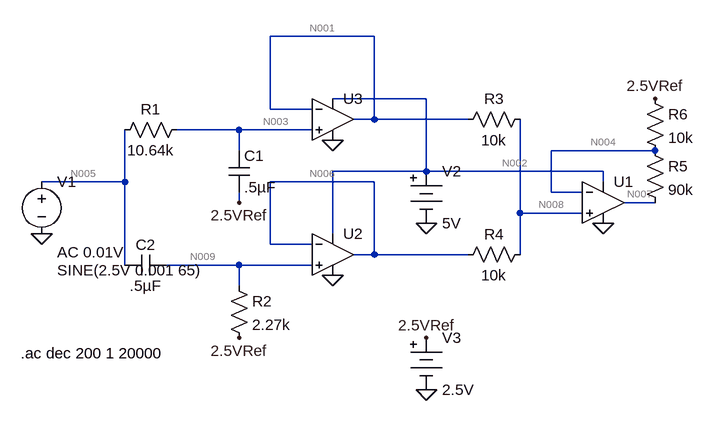
[diagram p0: schematic Band Stop Passive Filter.asc]
Band Stop Passive Filter.asc, the LTspice schematic file:
Version 4
SHEET 1 976 680
WIRE 480 -32 320 -32
WIRE 560 64 416 64
WIRE 320 80 320 -32
WIRE 384 80 320 80
WIRE 480 96 480 -32
WIRE 480 96 448 96
WIRE 624 96 480 96
WIRE 272 112 176 112
WIRE 384 112 272 112
WIRE 272 144 272 112
WIRE 912 144 752 144
WIRE 560 176 560 64
WIRE 560 176 416 176
WIRE 832 176 560 176
WIRE 96 192 96 112
WIRE 96 192 -32 192
WIRE 480 192 320 192
WIRE 832 192 832 176
WIRE 752 208 752 144
WIRE 800 208 752 208
WIRE 272 224 272 208
WIRE 912 224 864 224
WIRE 704 240 704 96
WIRE 800 240 704 240
WIRE 416 272 416 176
WIRE 320 288 320 192
WIRE 384 288 320 288
WIRE 480 304 480 192
WIRE 480 304 448 304
WIRE 624 304 480 304
WIRE 704 304 704 240
WIRE 96 320 96 192
WIRE 272 320 160 320
WIRE 384 320 272 320
WIRE 272 352 272 320
FLAG -32 272 0
FLAG 416 336 0
FLAG 416 128 0
FLAG 832 256 0
FLAG 560 256 0
FLAG 560 512 0
FLAG 560 432 2.5VRef
FLAG 272 432 2.5VRef
FLAG 272 224 2.5VRef
FLAG 912 64 2.5VRef
SYMBOL res 192 96 R90
WINDOW 0 0 56 VBottom 2
WINDOW 3 32 56 VTop 2
SYMATTR InstName R1
SYMATTR Value 10.64k
SYMBOL cap 256 144 R0
SYMATTR InstName C1
SYMATTR Value .5µF
SYMBOL voltage -32 176 R0
WINDOW 3 24 152 Left 2
WINDOW 123 24 124 Left 2
WINDOW 39 0 0 Left 2
SYMATTR Value SINE(2.5V 0.001 65)
SYMATTR Value2 AC 0.01V
SYMATTR InstName V1
SYMBOL cap 160 304 R90
WINDOW 0 0 32 VBottom 2
WINDOW 3 32 32 VTop 2
SYMATTR InstName C2
SYMATTR Value .5µF
SYMBOL res 256 336 R0
SYMATTR InstName R2
SYMATTR Value 2.27k
SYMBOL res 720 80 R90
WINDOW 0 0 56 VBottom 2
WINDOW 3 32 56 VTop 2
SYMATTR InstName R3
SYMATTR Value 10k
SYMBOL res 720 288 R90
WINDOW 0 0 56 VBottom 2
WINDOW 3 32 56 VTop 2
SYMATTR InstName R4
SYMATTR Value 10k
SYMBOL Misc\\battery 560 160 R0
WINDOW 123 0 0 Left 2
WINDOW 39 0 0 Left 2
SYMATTR InstName V2
SYMATTR Value 5V
SYMBOL Misc\\battery 560 416 R0
WINDOW 123 0 0 Left 2
WINDOW 39 0 0 Left 2
SYMATTR InstName V3
SYMATTR Value 2.5V
SYMBOL Opamps\\UniversalOpamp2 832 224 R0
SYMATTR InstName U1
SYMBOL Opamps\\UniversalOpamp2 416 304 R0
SYMATTR InstName U2
SYMBOL Opamps\\UniversalOpamp2 416 96 R0
SYMATTR InstName U3
SYMBOL res 896 128 R0
SYMATTR InstName R5
SYMATTR Value 90k
SYMBOL res 896 48 R0
SYMATTR InstName R6
SYMATTR Value 10k
TEXT -64 456 Left 2 !.ac dec 200 1 20000

The netlist it stands for:
* Band Stop Passive Filter.asc
R1 N003 N005 10.64k
C1 N003 2.5VRef .5µF
V1 N005 0 SINE(2.5V 0.001 65) AC 0.01V
C2 N009 N005 .5µF
R2 N009 2.5VRef 2.27k
R3 N008 N001 10k
R4 N008 N006 10k
V2 N002 0 5V
V3 2.5VRef 0 2.5V
XU1 N008 N004 N002 0 N007 level.2 Avol=1Meg GBW=10Meg Slew=10Meg ilimit=25m rail=0 Vos=0 phimargin=45 en=0 enk=0 in=0 ink=0 Rin=500Meg  ; pins IN+ IN- V+ V- OUT
XU2 N009 N006 N002 0 N006 level.2 Avol=1Meg GBW=10Meg Slew=10Meg ilimit=25m rail=0 Vos=0 phimargin=45 en=0 enk=0 in=0 ink=0 Rin=500Meg  ; pins IN+ IN- V+ V- OUT
XU3 N003 N001 N002 0 N001 level.2 Avol=1Meg GBW=10Meg Slew=10Meg ilimit=25m rail=0 Vos=0 phimargin=45 en=0 enk=0 in=0 ink=0 Rin=500Meg  ; pins IN+ IN- V+ V- OUT
R5 N004 N007 90k
R6 2.5VRef N004 10k
.ac dec 200 1 20000
.lib UniversalOpamps2.sub
.backanno
.end

* Results of the author's LTspice run, read from the files saved beside the schematic
* Operating Point, zero values left out:
*   V(n003) = 2.5 V
*   V(n005) = 2.5 V
*   V(2.5vref) = 2.5 V
*   V(n009) = 2.5 V
*   V(n008) = 2.5 V
*   V(n001) = 2.5 V
*   V(n006) = 2.5 V
*   V(n002) = 5 V
*   V(n007) = 2.5 V
*   V(n004) = 2.5 V
*   I(V2) = -750 µA
*   Ix(u1:3) = 250 µA
*   Ix(u1:4) = -250 µA
*   Ix(u1:5) = 198.4 pA
*   Ix(u2:3) = 250 µA
*   Ix(u2:4) = -250 µA
*   Ix(u2:5) = 198.3 pA
*   Ix(u3:3) = 250 µA
*   Ix(u3:4) = -250 µA
*   Ix(u3:5) = 198.3 pA
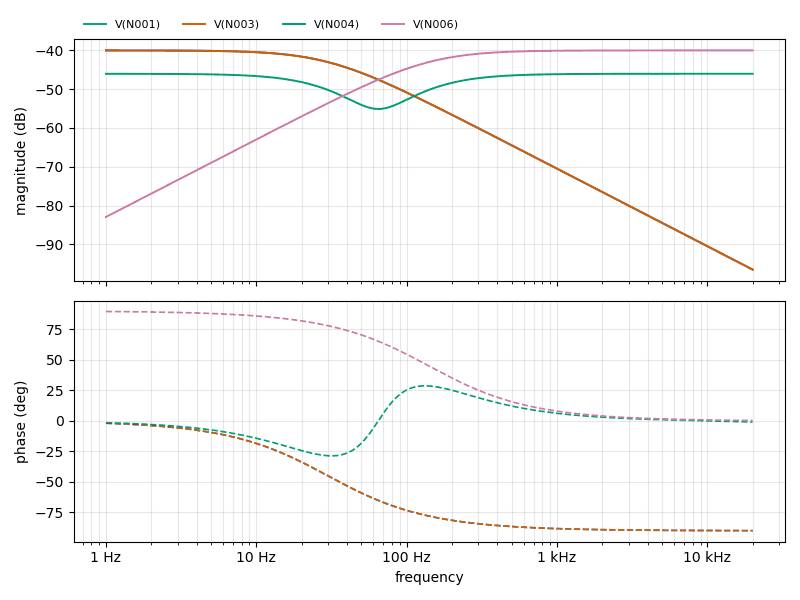
[diagram p1: AC Analysis of Band Stop Passive Filter.asc, plotted from the saved traces]
* AC Analysis, 1 run:
*   V(N001): -40.01 dB at 1 Hz, -96.53 dB at 20 kHz, peak -40.01 dB at 1 Hz, 3 dB below the peak at 29.95 Hz
*   V(N003): -40.01 dB at 1 Hz, -96.50 dB at 20 kHz, peak -40.01 dB at 1 Hz, 3 dB below the peak at 29.95 Hz
*   V(N004): -46.03 dB at 1 Hz, -46.02 dB at 20 kHz, peak -46.02 dB at 12.59 kHz, 3 dB below the peak at 172 Hz
*   V(N006): -82.94 dB at 1 Hz, -40.00 dB at 20 kHz, peak -40.00 dB at 20 kHz, 3 dB below the peak at 140.2 Hz